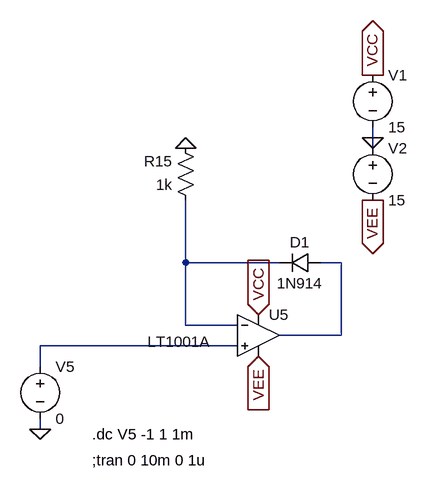
[diagram p0: schematic Superdiode.asc]
Superdiode.asc, the LTspice schematic file:
Version 4
SHEET 1 3400 680
WIRE 1456 64 1456 48
WIRE 1456 80 1456 64
WIRE 1168 256 1168 160
WIRE 1312 256 1168 256
WIRE 1408 256 1376 256
WIRE 1168 352 1168 256
WIRE 1248 352 1168 352
WIRE 1408 368 1408 256
WIRE 1408 368 1312 368
WIRE 1248 384 944 384
WIRE 944 416 944 384
WIRE 944 512 944 496
FLAG 1456 64 0
FLAG 944 512 0
FLAG 1168 80 0
FLAG 1456 -32 VCC
IOPIN 1456 -32 Out
FLAG 1280 336 VCC
IOPIN 1280 336 In
FLAG 1456 160 VEE
IOPIN 1456 160 Out
FLAG 1280 400 VEE
IOPIN 1280 400 In
SYMBOL voltage 1456 -48 R0
WINDOW 123 0 0 Left 2
WINDOW 39 0 0 Left 2
SYMATTR InstName V1
SYMATTR Value 15
SYMBOL voltage 1456 64 R0
WINDOW 123 0 0 Left 2
WINDOW 39 0 0 Left 2
SYMATTR InstName V2
SYMATTR Value 15
SYMBOL Opamps\\LT1001A 1280 304 R0
WINDOW 3 -171 74 Left 2
SYMATTR InstName U5
SYMBOL res 1184 176 R180
WINDOW 0 36 76 Left 2
WINDOW 3 36 40 Left 2
SYMATTR InstName R15
SYMATTR Value 1k
SYMBOL voltage 944 400 R0
WINDOW 123 0 0 Left 2
WINDOW 39 0 0 Left 2
SYMATTR InstName V5
SYMATTR Value 0
SYMBOL diode 1376 240 R90
WINDOW 0 0 32 VBottom 2
WINDOW 3 32 32 VTop 2
SYMATTR InstName D1
SYMATTR Value 1N914
TEXT 1024 520 Left 2 !.dc V5 -1 1 1m
TEXT 1024 560 Left 2 !;tran 0 10m 0 1u

The netlist it stands for:
* Superdiode.asc
V1 VCC 0 15
V2 0 VEE 15
XU5 N003 N001 VCC VEE N002 LT1001  ; LT1001A, pins In+ In- V+ V- OUT
R15 N001 0 1k
V5 N003 0 0
D1 N002 N001 1N914
.model D D
.lib standard.dio
.dc V5 -1 1 1m
;tran 0 10m 0 1u
.lib LTC.lib
.backanno
.end